# Altium schematic sheet Input_Section.SchDoc
size A4; DocumentNumber: 3; SheetNumber: 3; SheetTotal: 6
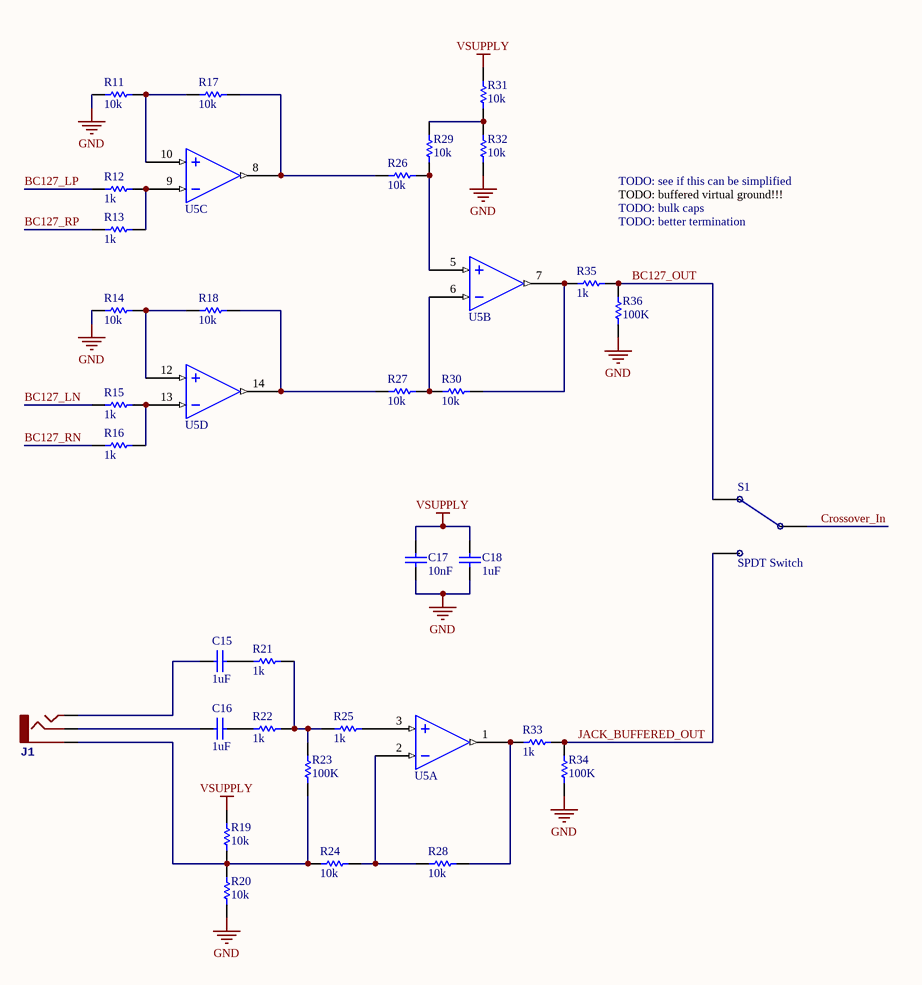
[diagram p0: Input_Section.SchDoc]

## Parts
C15  1uF  [CAP Radial 5mm]
C16  1uF  [CAP Radial 5mm]
C17  10nF  [CAPC1608X09N]
C18  1uF  [CAPC1608X09N]
J1  3.5mm Audio Jack  [70543-0002]  (value not drawn)
R11  10k  [RESC1608X06N]
R12  1k  [RESC1608X06N]
R13  1k  [RESC1608X06N]
R14  10k  [RESC1608X06N]
R15  1k  [RESC1608X06N]
R16  1k  [RESC1608X06N]
R17  10k  [RESC1608X06N]
R18  10k  [RESC1608X06N]
R19  10k  [RESC1608X06N]
R20  10k  [RESC1608X06N]
R21  1k  [RESC1608X06N]
R22  1k  [RESC1608X06N]
R23  100K  [RESC1608X06N]
R24  10k  [RESC1608X06N]
R25  1k  [RESC1608X06N]
R26  10k  [RESC1608X06N]
R27  10k  [RESC1608X06N]
R28  10k  [RESC1608X06N]
R29  10k  [RESC1608X06N]
R30  10k  [RESC1608X06N]
R31  10k  [RESC1608X06N]
R32  10k  [RESC1608X06N]
R33  1k  [RESC1608X06N]
R34  100K  [RESC1608X06N]
R35  1k  [RESC1608X06N]
R36  100K  [RESC1608X06N]
S1  SPDT Switch  [70543-0002]
U5  OPA4134UA  [SOIC127P600X175-14N]  (value not drawn)  (parts A,B,C,D of 4)

## Nets
GND: C17.1 C18.2 R11.1 R14.1 R20.1 R32.1 R34.1 R36.1 U5.11(V-)
VSUPPLY: C17.2 C18.1 R19.2 R31.2 U5.4(V+)
BC127_LN: R15.1
BC127_LP: R12.1
BC127_OUT: R35.2 R36.2 S1.2
BC127_RN: R16.1
BC127_RP: R13.1
Crossover_In: S1.1
JACK_BUFFERED_OUT: R33.2 R34.2 S1.3
NetC15_1: C15.1 J1.3(LEFT)
NetC15_2: C15.2 R21.1
NetC16_1: C16.1 J1.2(RIGHT)
NetC16_2: C16.2 R22.1
NetJ1_1: J1.1(SLEEVE) R19.1 R20.2 R23.1 R24.1
NetR11_2: R11.2 R17.1 U5.10(+In_C)
NetR12_2: R12.2 R13.2 U5.9(-In_C)
NetR14_2: R14.2 R18.1 U5.12(+In_D)
NetR15_2: R15.2 R16.2 U5.13(-In_D)
NetR17_2: R17.2 R26.1 U5.8(Out_C)
NetR18_2: R18.2 R27.1 U5.14(Out_D)
NetR21_2: R21.2 R22.2 R23.2 R25.1
NetR24_2: R24.2 R28.1 U5.2(-In_A)
NetR25_2: R25.2 U5.3(+In_A)
NetR26_2: R26.2 R29.1 U5.5(+In_B)
NetR27_2: R27.2 R30.2 U5.6(-In_B)
NetR28_2: R28.2 R33.1 U5.1(Out_A)
NetR29_2: R29.2 R31.1 R32.2
NetR30_1: R30.1 R35.1 U5.7(Out_B)

## Notes on the sheet
- TODO: see if this can be simplified
- TODO: buffered virtual ground!!!
- TODO: bulk caps
- TODO: better termination

## Library data of the parts
C15 C16 = CAP 1uF Radial 5mm: Audio coupling cap; Manufacturer: EPCOS (TDK); Manufacturer P/N: B32529C105J; Voltage: 63V; Value: 1uF; Digikey Part Number: 495-1119-ND
C17 = CAP CER 10nF 0603: Bypass caps; Manufacturer: Murata; Value: 10nF; Digikey Part Number: 490-9666-1-ND
C18 = CAP CER 1uF 0603: Voltage: 35V; Value: 1uF; Digikey Part Number: 490-10487-1-ND
R11 R14 R17-R20 R24 R26-R32 = RES 10K 0603: Manufacturer: Yageo; Manufacturer Part Number: RC0603FR-0710KL; Tolerance: 1%; Power: 0.1W; Type: RES; Footprint: 0603; Temperature: 155dC; Digikey Part Number: 311-10.0KHRCT-ND; Value: 10k
R12 R13 R15 R16 R21 R22 R25 R33 R35 = RES 1K 0603: Manufacturer: Panasonic; Manufacturer Part Number: ERJ-PA3F1001V; Tolerance: 1%; Power: 0.25W; Type: RES; Footprint: 0603; Temperature: 155dC; Digikey Part Number: P1.0KBYCT-ND; Value: 1k
R23 R34 R36 = RES 100K 0603: Tolerance: 1%; Power: 0.1W; Footprint: 0603; Value: 100K; Digikey Part Number: 311-100KHRCT-ND
U5 = OPA4134UA: Quad OPAx134 Operational Amplifier; Digikey Part Number: 296-26284-1-ND